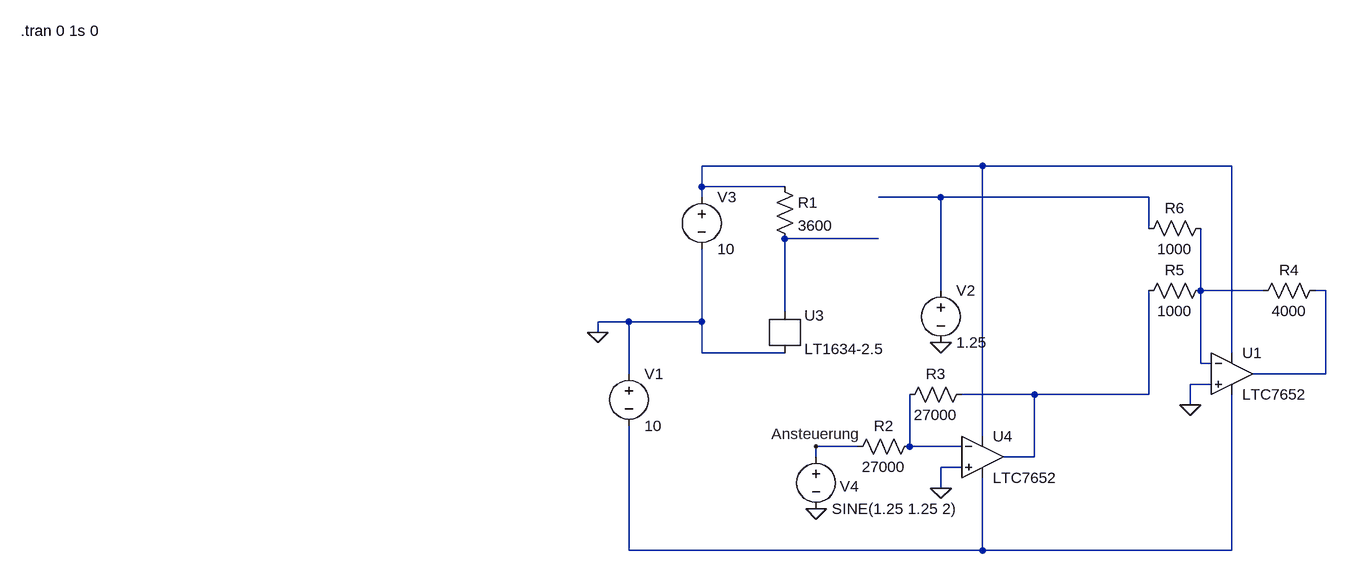
[diagram p0: schematic Adder-V0-1.asc]
Adder-V0-1.asc, the LTspice schematic file:
Version 4
SHEET 1 1604 792
WIRE 1056 48 624 48
WIRE 1440 48 1056 48
WIRE 624 80 624 48
WIRE 752 80 624 80
WIRE 624 96 624 80
WIRE 992 96 896 96
WIRE 1312 96 992 96
WIRE 1312 144 1312 96
WIRE 896 160 752 160
WIRE 992 240 992 96
WIRE 1392 240 1392 144
WIRE 1488 240 1392 240
WIRE 1584 240 1568 240
WIRE 752 272 752 160
WIRE 512 288 464 288
WIRE 624 288 624 176
WIRE 624 288 512 288
WIRE 464 304 464 288
WIRE 624 336 624 288
WIRE 752 336 624 336
WIRE 1440 336 1440 48
WIRE 1392 352 1392 240
WIRE 1408 352 1392 352
WIRE 512 368 512 288
WIRE 1584 368 1584 240
WIRE 1584 368 1472 368
WIRE 1408 384 1376 384
WIRE 1136 400 1024 400
WIRE 1312 400 1312 240
WIRE 1312 400 1136 400
WIRE 1376 416 1376 384
WIRE 1056 464 1056 48
WIRE 864 480 800 480
WIRE 944 480 944 400
WIRE 1024 480 944 480
WIRE 800 496 800 480
WIRE 1136 496 1136 400
WIRE 1136 496 1088 496
WIRE 1024 512 992 512
WIRE 992 544 992 512
WIRE 512 640 512 448
WIRE 1056 640 1056 528
WIRE 1056 640 512 640
WIRE 1440 640 1440 400
WIRE 1440 640 1056 640
FLAG 464 304 0
FLAG 800 576 0
FLAG 800 480 Ansteuerung
FLAG 992 544 0
FLAG 1376 416 0
FLAG 992 320 0
SYMBOL voltage 624 80 R0
WINDOW 123 0 0 Left 2
WINDOW 39 0 0 Left 2
SYMATTR InstName V3
SYMATTR Value 10
SYMBOL res 736 64 R0
SYMATTR InstName R1
SYMATTR Value 3600
SYMBOL voltage 800 480 R0
WINDOW 0 37 61 Left 2
WINDOW 123 24 124 Left 2
WINDOW 39 0 0 Left 2
SYMATTR InstName V4
SYMATTR Value SINE(1.25 1.25 2)
SYMBOL References\\LT1634-2.5 752 304 R0
SYMATTR InstName U3
SYMBOL voltage 512 352 R0
WINDOW 123 0 0 Left 2
WINDOW 39 0 0 Left 2
SYMATTR InstName V1
SYMATTR Value 10
SYMBOL Opamps\\LTC7652 1056 432 R0
SYMATTR InstName U4
SYMBOL res 960 464 R90
WINDOW 0 0 56 VBottom 2
WINDOW 3 32 56 VTop 2
SYMATTR InstName R2
SYMATTR Value 27000
SYMBOL res 1040 384 R90
WINDOW 0 0 56 VBottom 2
WINDOW 3 32 56 VTop 2
SYMATTR InstName R3
SYMATTR Value 27000
SYMBOL Opamps\\LTC7652 1440 304 R0
SYMATTR InstName U1
SYMBOL res 1584 224 R90
WINDOW 0 0 56 VBottom 2
WINDOW 3 32 56 VTop 2
SYMATTR InstName R4
SYMATTR Value 4000
SYMBOL res 1408 224 R90
WINDOW 0 0 56 VBottom 2
WINDOW 3 32 56 VTop 2
SYMATTR InstName R5
SYMATTR Value 1000
SYMBOL res 1408 128 R90
WINDOW 0 0 56 VBottom 2
WINDOW 3 32 56 VTop 2
SYMATTR InstName R6
SYMATTR Value 1000
SYMBOL voltage 992 224 R0
WINDOW 123 0 0 Left 2
WINDOW 39 0 0 Left 2
SYMATTR InstName V2
SYMATTR Value 1.25
TEXT -424 -160 Left 2 !.tran 0 1s 0

The netlist it stands for:
* Adder-V0-1.asc
V3 N001 0 10
R1 N001 N003 3600
V4 Ansteuerung 0 SINE(1.25 1.25 2)
XU3 N003 0 LT1634-2.5
V1 0 N008 10
XU4 0 N007 N001 N008 N006 LTC1052  ; LTC7652, pins In+ In- V+ V- OUT
R2 N007 Ansteuerung 27000
R3 N006 N007 27000
XU1 0 N004 N001 N008 N005 LTC1052  ; LTC7652, pins In+ In- V+ V- OUT
R4 N005 N004 4000
R5 N004 N006 1000
R6 N004 N002 1000
V2 N002 0 1.25
.tran 0 1s 0
.backanno
.end